# EAGLE schematic CTD_sch (EAGLE 9.6.2)
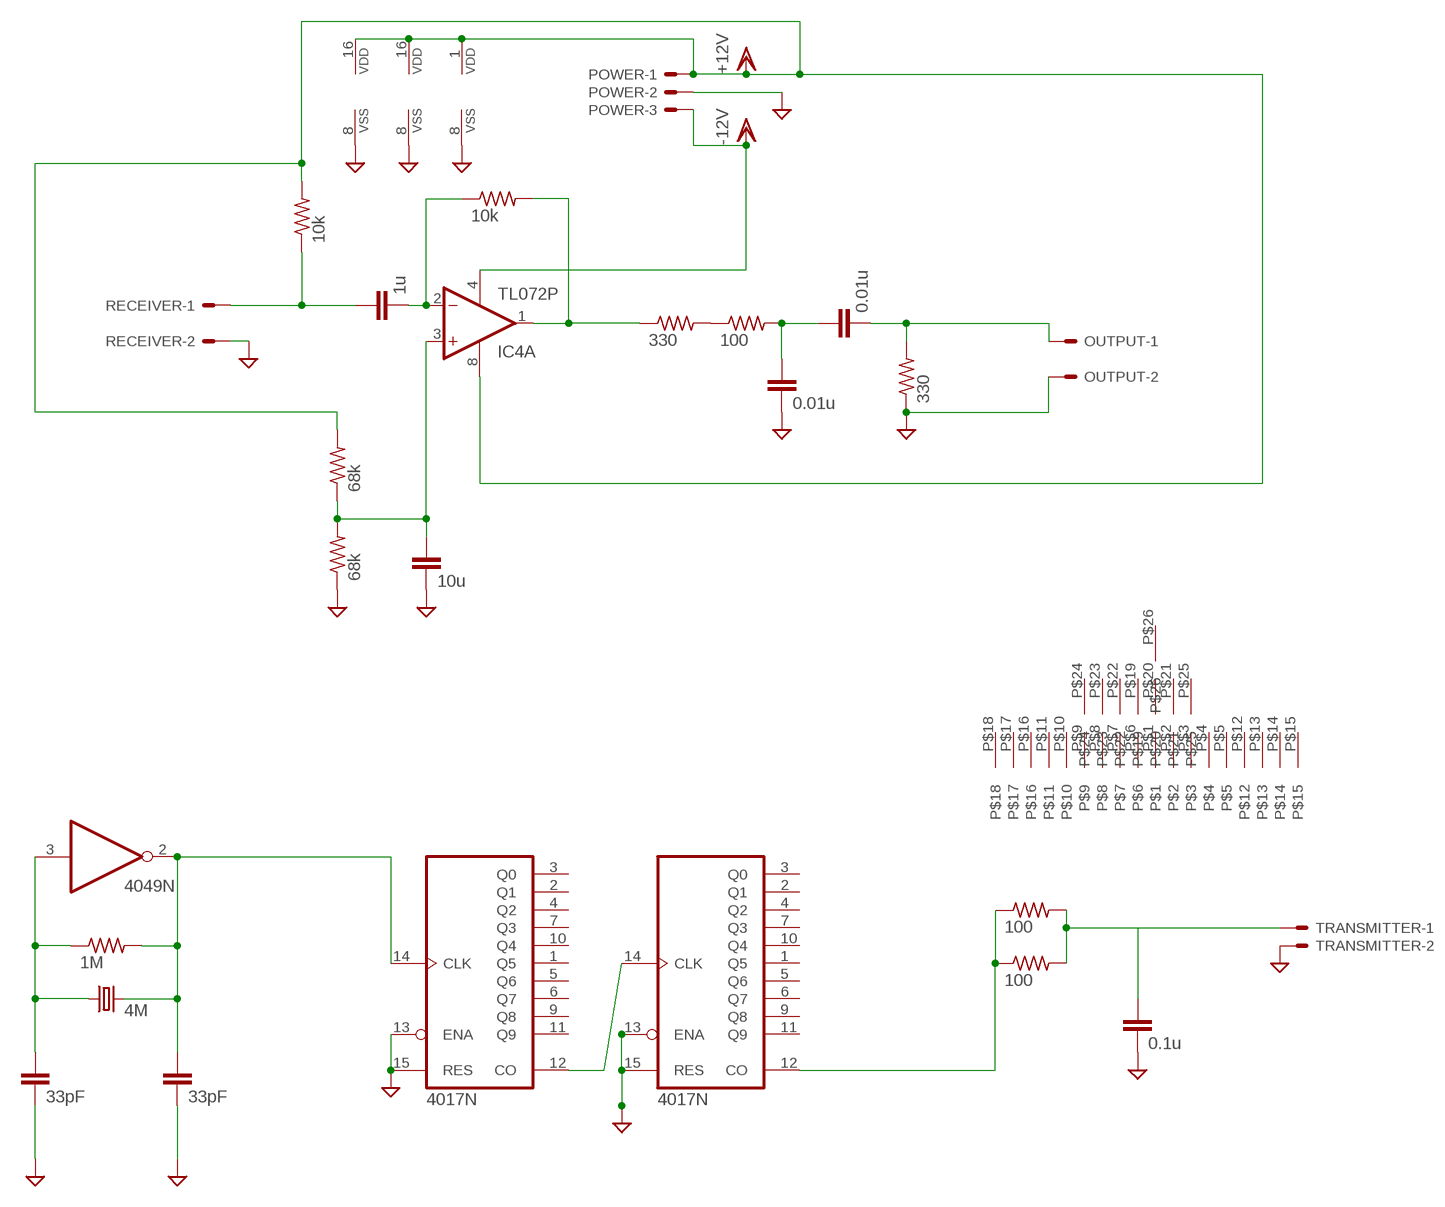
[diagram p0: schematic, sheet 1]

## Parts
C1  33pF  C5/3.5  [C5B3.5]
C2  33pF  C5/3.5  [C5B3.5]
C3  0.1u  C5/3.5  [C5B3.5]
C4  10u  C5/3.5  [C5B3.5]
C5  1u  C5/3.5  [C5B3.5]
C6  0.01u  C5/3.5  [C5B3.5]
C7  0.01u  C5/3.5  [C5B3.5]
IC1  4017N  [DIL16]
IC2  4017N  [DIL16]
IC3  4049N  [DIL16]
IC4  TL072P  [DIL08]
OUTPUT  C-GRID-02-70543  [70543-02]
POWER  C-GRID-03-70543  [70543-03]
Q1  4M  CRYSTALHC49U-V  [HC49U-V]
R1  1M  R-US_0207/12  [0207/12]
R2  100  R-US_0207/12  [0207/12]
R3  100  R-US_0207/12  [0207/12]
R4  68k  R-US_0207/12  [0207/12]
R5  10k  R-US_0207/12  [0207/12]
R6  10k  R-US_0207/12  [0207/12]
R7  68k  R-US_0207/12  [0207/12]
R8  330  R-US_0207/12  [0207/12]
R9  100  R-US_0207/12  [0207/12]
R10  330  R-US_0207/12  [0207/12]
RECEIVER  C-GRID-02-70543  [70543-02]
TRANSMITTER  C-GRID-02-70543  [70543-02]
U$1  G-11G-11  [G-11]

## Nets
GND: C1.2 C2.2 C3.2 C4.2 C6.2 IC1.8(VSS) IC1.13(ENA) IC1.15(RES) IC2.8(VSS) IC2.13(ENA) IC2.15(RES) IC3.8(P:VSS) OUTPUT.2 POWER.2 R4.1 R10.1 RECEIVER.2 TRANSMITTER.2
N$1: C2.1 IC3.3(A:I) Q1.1 R1.1
N$2: C1.1 IC1.14(CLK) IC3.2(A:O) Q1.2 R1.2
N$3: IC1.12(CO) IC2.14(CLK)
N$4: IC2.12(CO) R2.1 R3.1
N$5: C3.1 R2.2 R3.2 TRANSMITTER.1
N$6: R8.2 R9.1
N$7: C4.1 IC4.3(A:+IN) R4.2 R7.1
N$8: C5.2 IC4.2(A:-IN) R6.1
N$9: C5.1 R5.1 RECEIVER.1
N$10: IC4.1(A:OUT) R6.2 R8.1
N$11: C6.1 C7.1 R9.2
N$12: C7.2 OUTPUT.1 R10.2
N$16: IC4.4(P:V-) POWER.3 ; supply symbol labelled -12V
VDD: IC1.16(VDD) IC2.16(VDD) IC3.1(P:VDD) IC4.8(P:V+) POWER.1 R5.2 R7.2 ; supply symbol labelled +12V
Unconnected: IC1.1(Q5) IC1.2(Q1) IC1.3(Q0) IC1.4(Q2) IC1.5(Q6) IC1.6(Q7) IC1.7(Q3) IC1.9(Q8) IC1.10(Q4) IC1.11(Q9) IC2.1(Q5) IC2.2(Q1) IC2.3(Q0) IC2.4(Q2) IC2.5(Q6) IC2.6(Q7) IC2.7(Q3) IC2.9(Q8) IC2.10(Q4) IC2.11(Q9) IC3.4(B:O) IC3.5(B:I) IC3.6(C:O) IC3.7(C:I) IC3.9(D:I) IC3.10(D:O) IC3.11(E:I) IC3.12(E:O) IC3.14(F:I) IC3.15(F:O) IC4.5(B:+IN) IC4.6(B:-IN) IC4.7(B:OUT) U$1.P$1 U$1.P$2 U$1.P$3 U$1.P$4 U$1.P$5 U$1.P$6 U$1.P$7 U$1.P$8 U$1.P$9 U$1.P$10 U$1.P$11 U$1.P$12 U$1.P$13 U$1.P$14 U$1.P$15 U$1.P$16 U$1.P$17 U$1.P$18 U$1.P$19 U$1.P$20 U$1.P$21 U$1.P$22 U$1.P$23 U$1.P$24 U$1.P$25 U$1.P$26

## Library data of the parts
C1-C7 = capacitor-wima:C: CAPACITOR naming: grid - package width
IC1 IC2 = 40xx:4017: COUNTER/DIVIDER
IC3 = 40xx:4049: Hex inverting BUFFER
IC4 = linear:TL072: OP AMP
OUTPUT RECEIVER TRANSMITTER = con-molex:C-GRID-02: CONNECTOR wire to board 2.54 mm (0.100") pitch header; MF: MOLEX; OC_FARNELL: unknown; OC_NEWARK: unknown
POWER = con-molex:C-GRID-03: CONNECTOR wire to board 2.54 mm (0.100") pitch header; MF: MOLEX; OC_FARNELL: unknown; OC_NEWARK: unknown
Q1 = crystal:CRYSTAL: CRYSTAL; OC_FARNELL: 1666969; OC_NEWARK: unknown
R1-R10 = rcl:R-US_: RESISTOR, American symbol; SPICEPREFIX: R
U$1 = G-11:G-11

## Net classes
0 default: width 0.152 mm, drill 0.6 mm, clearance 0.152 mm